# Altium schematic sheet KSZ_Switch.SchDoc
size A4; DrawnBy: Emile Renaud; Revision: V1.0; SheetNumber: 5; SheetTotal: 8
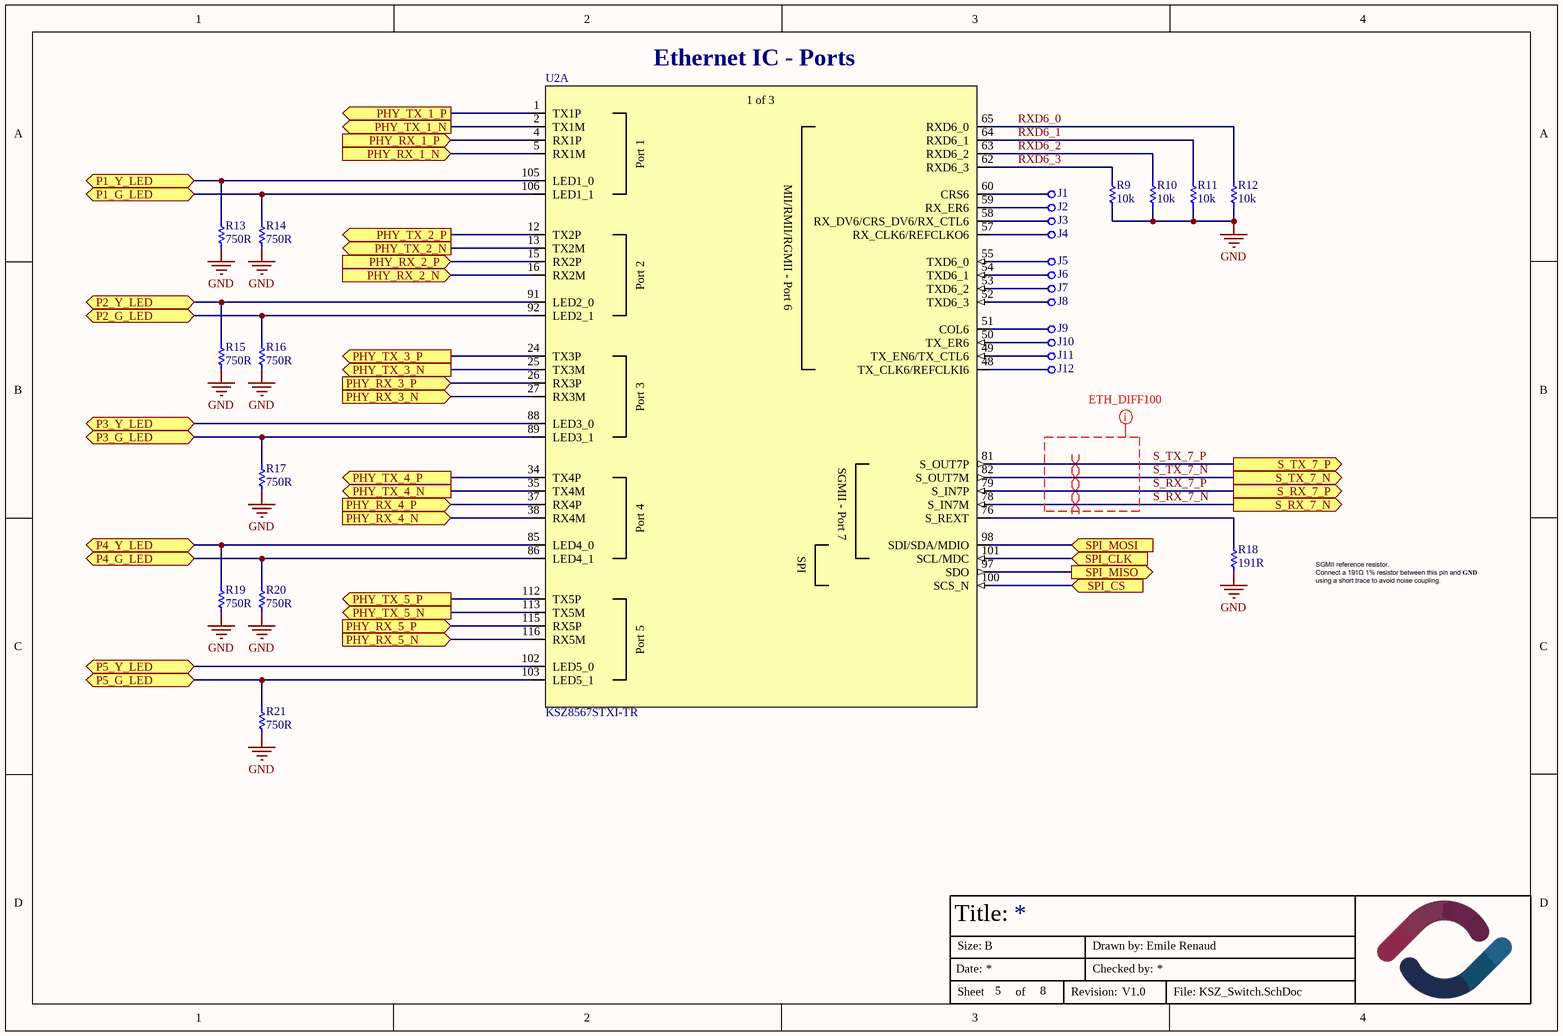
[diagram p0: KSZ_Switch.SchDoc]

## Parts
J1  hole  [PAD-0.53MM]  (value not drawn)  (no BOM)
J2  hole  [PAD-0.53MM]  (value not drawn)  (no BOM)
J3  hole  [PAD-0.53MM]  (value not drawn)  (no BOM)
J4  hole  [PAD-0.53MM]  (value not drawn)  (no BOM)
J5  hole  [PAD-0.53MM]  (value not drawn)  (no BOM)
J6  hole  [PAD-0.53MM]  (value not drawn)  (no BOM)
J7  hole  [PAD-0.53MM]  (value not drawn)  (no BOM)
J8  hole  [PAD-0.53MM]  (value not drawn)  (no BOM)
J9  hole  [PAD-0.53MM]  (value not drawn)  (no BOM)
J10  hole  [PAD-0.53MM]  (value not drawn)  (no BOM)
J11  hole  [PAD-0.53MM]  (value not drawn)  (no BOM)
J12  hole  [PAD-0.53MM]  (value not drawn)  (no BOM)
R9  value 10k  [Resistor-0603]  (hidden comment: SMT resistor)
R10  value 10k  [Resistor-0603]  (hidden comment: SMT resistor)
R11  value 10k  [Resistor-0603]  (hidden comment: SMT resistor)
R12  value 10k  [Resistor-0603]  (hidden comment: SMT resistor)
R13  value 750R  [Resistor-0603]  (hidden comment: SMT resistor)
R14  value 750R  [Resistor-0603]  (hidden comment: SMT resistor)
R15  value 750R  [Resistor-0603]  (hidden comment: SMT resistor)
R16  value 750R  [Resistor-0603]  (hidden comment: SMT resistor)
R17  value 750R  [Resistor-0603]  (hidden comment: SMT resistor)
R18  value 191R  [Resistor-0603]  (hidden comment: SMT resistor)
R19  value 750R  [Resistor-0603]  (hidden comment: SMT resistor)
R20  value 750R  [Resistor-0603]  (hidden comment: SMT resistor)
R21  value 750R  [Resistor-0603]  (hidden comment: SMT resistor)
U2  KSZ8567STXI-TR  [TQFP128_EP_6XX_MCH-M]  (part A of 3)

## Ports
P1_G_LED (bidir), P1_Y_LED (bidir), P2_G_LED (bidir), P2_Y_LED (bidir), P3_G_LED (bidir), P3_Y_LED (bidir), P4_G_LED (bidir), P4_Y_LED (bidir), P5_G_LED (bidir), P5_Y_LED (bidir), PHY_RX_1_N (in), PHY_RX_1_P (in), PHY_RX_2_N (in), PHY_RX_2_P (in), PHY_RX_3_N (in), PHY_RX_3_P (in), PHY_RX_4_N (in), PHY_RX_4_P (in), PHY_RX_5_N (in), PHY_RX_5_P (in), PHY_TX_1_N (out), PHY_TX_1_P (out), PHY_TX_2_N (out), PHY_TX_2_P (out), PHY_TX_3_N (out), PHY_TX_3_P (out), PHY_TX_4_N (out), PHY_TX_4_P (out), PHY_TX_5_N (out), PHY_TX_5_P (out), S_RX_7_N (out), S_RX_7_P (out), S_TX_7_N (out), S_TX_7_P (out), SPI_CLK (in), SPI_CS (in), SPI_MISO (out), SPI_MOSI (in)

## Nets
GND: R9.1 R10.1 R11.1 R12.1 R13.1 R14.1 R15.1 R16.1 R17.1 R18.1 R19.1 R20.1 R21.1
P1_G_LED: R14.2 U2.106(LED1_1) ; port P1_G_LED
P1_Y_LED: R13.2 U2.105(LED1_0) ; port P1_Y_LED
P2_G_LED: R16.2 U2.92(LED2_1) ; port P2_G_LED
P2_Y_LED: R15.2 U2.91(LED2_0) ; port P2_Y_LED
P3_G_LED: R17.2 U2.89(LED3_1) ; port P3_G_LED
P3_Y_LED: U2.88(LED3_0) ; port P3_Y_LED
P4_G_LED: R20.2 U2.86(LED4_1) ; port P4_G_LED
P4_Y_LED: R19.2 U2.85(LED4_0) ; port P4_Y_LED
P5_G_LED: R21.2 U2.103(LED5_1) ; port P5_G_LED
P5_Y_LED: U2.102(LED5_0) ; port P5_Y_LED
PHY_RX_1_N: U2.5(RX1M) ; port PHY_RX_1_N
PHY_RX_1_P: U2.4(RX1P) ; port PHY_RX_1_P
PHY_RX_2_N: U2.16(RX2M) ; port PHY_RX_2_N
PHY_RX_2_P: U2.15(RX2P) ; port PHY_RX_2_P
PHY_RX_3_N: U2.27(RX3M) ; port PHY_RX_3_N
PHY_RX_3_P: U2.26(RX3P) ; port PHY_RX_3_P
PHY_RX_4_N: U2.38(RX4M) ; port PHY_RX_4_N
PHY_RX_4_P: U2.37(RX4P) ; port PHY_RX_4_P
PHY_RX_5_N: U2.116(RX5M) ; port PHY_RX_5_N
PHY_RX_5_P: U2.115(RX5P) ; port PHY_RX_5_P
PHY_TX_1_N: U2.2(TX1M) ; port PHY_TX_1_N
PHY_TX_1_P: U2.1(TX1P) ; port PHY_TX_1_P
PHY_TX_2_N: U2.13(TX2M) ; port PHY_TX_2_N
PHY_TX_2_P: U2.12(TX2P) ; port PHY_TX_2_P
PHY_TX_3_N: U2.25(TX3M) ; port PHY_TX_3_N
PHY_TX_3_P: U2.24(TX3P) ; port PHY_TX_3_P
PHY_TX_4_N: U2.35(TX4M) ; port PHY_TX_4_N
PHY_TX_4_P: U2.34(TX4P) ; port PHY_TX_4_P
PHY_TX_5_N: U2.113(TX5M) ; port PHY_TX_5_N
PHY_TX_5_P: U2.112(TX5P) ; port PHY_TX_5_P
RXD6_0: R12.2 U2.65(RXD6_0)
RXD6_1: R11.2 U2.64(RXD6_1)
RXD6_2: R10.2 U2.63(RXD6_2)
RXD6_3: R9.2 U2.62(RXD6_3)
S_RX_7_N: U2.78(S_IN7M) ; port S_RX_7_N
S_RX_7_P: U2.79(S_IN7P) ; port S_RX_7_P
S_TX_7_N: U2.82(S_OUT7M) ; port S_TX_7_N
S_TX_7_P: U2.81(S_OUT7P) ; port S_TX_7_P
SPI_CLK: U2.101(SCL/MDC) ; port SPI_CLK
SPI_CS: U2.100(SCS_N) ; port SPI_CS
SPI_MISO: U2.97(SDO) ; port SPI_MISO
SPI_MOSI: U2.98(SDI/SDA/MDIO) ; port SPI_MOSI
NetJ1_1: J1.1 U2.60(CRS6)
NetJ2_1: J2.1 U2.59(RX_ER6)
NetJ3_1: J3.1 U2.58(RX_DV6/CRS_DV6/RX_CTL6)
NetJ4_1: J4.1 U2.57(RX_CLK6/REFCLKO6)
NetJ5_1: J5.1 U2.55(TXD6_0)
NetJ6_1: J6.1 U2.54(TXD6_1)
NetJ7_1: J7.1 U2.53(TXD6_2)
NetJ8_1: J8.1 U2.52(TXD6_3)
NetJ9_1: J9.1 U2.51(COL6)
NetJ10_1: J10.1 U2.50(TX_ER6)
NetJ11_1: J11.1 U2.49(TX_EN6/TX_CTL6)
NetJ12_1: J12.1 U2.48(TX_CLK6/REFCLKI6)
NetR18_2: R18.2 U2.76(S_REXT)

## Layout directives
differential pair: S_RX_7_N, S_RX_7_P, S_TX_7_N, S_TX_7_P
net class MDI_DIFF100: (no net found under the mark)

## Notes on the sheet
- (near U2) Ethernet IC - Ports
- Title:
- Date:
- Size:
- B
- Drawn by:
- Checked by:
- Sheet
- of
- Revision:
- File:
- (in symbol KSZ8567STXI-TR, part A) 1 of 3; Port 1; MII/RMII/RGMII - Port 6; Port 2; Port 3; SGMII - Port 7; Port 4; SPI; Port 5

## Library data of the parts
J1-J12 = PAD 0.53mm AWG28-Solid: PAD for 28 AWG Solid Wire; Mounted: N/A
R9-R12 = Resistor-0603-10k: Resistor0603-10k; Precision: 1%; Watt: 0.1W; Mounted: Yes; Package / Case: Metric 1608, EIA 0603; Supplier 1: Digi-Key; Supplier Part Number 1: 311-10.0KHRTR-ND
R13-R17 R19-R21 = Resistor-0603-750R: Resistor0603-750R; Precision: 1%; Watt: 0.1W; Mounted: Yes; Package / Case: Metric 1608, EIA 0603; Supplier 1: Digi-Key; Supplier Part Number 1: 311-750HRCT-ND
R18 = Resistor-0603-191R: Precision: 1%; Watt: 0.1W; Mounted: Yes; Package / Case: Metric 1608, EIA 0603; Supplier 1: Digi-Key; Supplier Part Number 1: 311-191HRCT-ND
U2 = KSZ8567STXI-TR: IC ETHERNET SWITCH 7PORT 128TQFP; Package / Case: 128TQFP; Mounted: Yes; Supplier 1: Digikey; Supplier Part Number 1: KSZ8567STXI-CT-ND; HelpURL: https://ww1.microchip.com/downloads/aemDocuments/documents/OTH/ProductDocuments/DataSheets/KSZ8567S-Data-Sheet-DS00002391C.pdf